# Altium project magnetic_encoder.PrjPcb
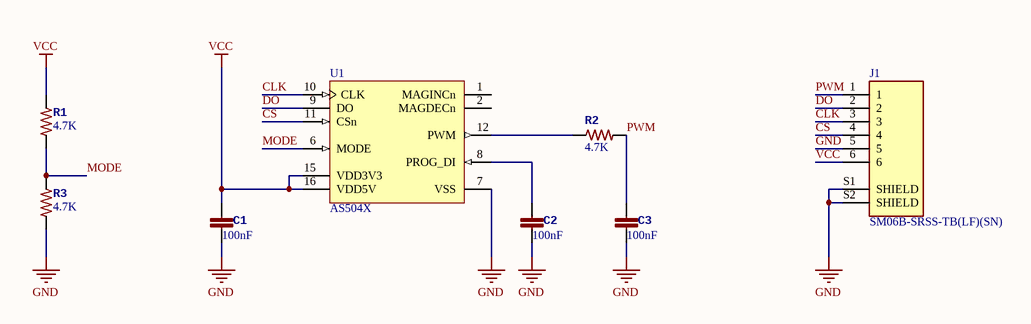
[diagram p0: schematic.SchDoc]
1 sheet, 8 parts. Net scope: global (net labels, ports and power ports of the same name join across sheets).
Board file: PCB.PcbDoc

## Sheet schematic.SchDoc
size A

### Parts
C1  value 100nF  [_0805]  (hidden comment: Cap)
C2  value 100nF  [_0805]  (hidden comment: Cap)
C3  value 100nF  [_0805]  (hidden comment: Cap)
J1  SM06B-SRSS-TB(LF)(SN)  [JST_SM06B-SRSS-TB(LF)(SN)]
R1  value 4.7K  [_0805]  (hidden comment: Resistor)
R2  value 4.7K  [_0805]  (hidden comment: Resistor)
R3  value 4.7K  [_0805]  (hidden comment: Resistor)
U1  AS504X  [AS504X]

### Nets
GND: C1.2 C2.2 C3.2 J1.5 J1.S1(SHIELD) J1.S2(SHIELD) R3.2 U1.7(VSS)
VCC: C1.1 J1.6 R1.1 U1.15(VDD3V3) U1.16(VDD5V)
CLK: J1.3 U1.10(CLK)
CS: J1.4 U1.11(CSn)
DO: J1.2 U1.9(DO)
MODE: R1.2 R3.1 U1.6(MODE)
PWM: C3.1 J1.1 R2.2
NetC2_1: C2.1 U1.8(PROG_DI)
NetR2_1: R2.1 U1.12(PWM)

Not connected (* = marked no-connect by the designer): U1 1(MAGINCn) 2(MAGDECn)

### Library data of the parts
C1-C3 = Cap_1
J1 = SM06B-SRSS-TB(LF)(SN): Connector Header Surface Mount, Right Angle 6 position 0.039 _1.00mm_; MP: SM06B-SRSS-TB_LF__SN_; MF: JST Sales; Package: None; Value: *; SnapEDA_Link: https://www.snapeda.com/parts/SM06B-SRSS-TB%28LF%29%28SN%29/JST%20Sales%20America%20Inc./view-part/554386/?ref=snap; Digi-Key_Purchase_URL: https://www.digikey.com/product-detail/en/jst-sales-america-inc/SM06B-SRSS-TB_LF__SN_/455-1806-1-ND/926877?utm_source=snapeda&utm_medium=aggregator&utm_campaign=symbol; Digi-Key_Part_Number: 455-1806-1-ND